# EasyEDA Pro project wt901c固定板_2026-02-21.epro

# Schematic Wt901固定板
Board Name: Board1; Create Date: 2026-02-02; Page Name: P1; Project Name: 莺飞; Schematic Name: Schematic10; Update Date: 2026-02-02; BladeWidth: 10; Company: 嘉立创EDA; Page Size: A4; RegionStart: 1; ShowBorder: 1; TitleBlock: 1; TitleBlockPosition: 3; Version: V1.0; XRegionCount: 6; YRegionCount: 4
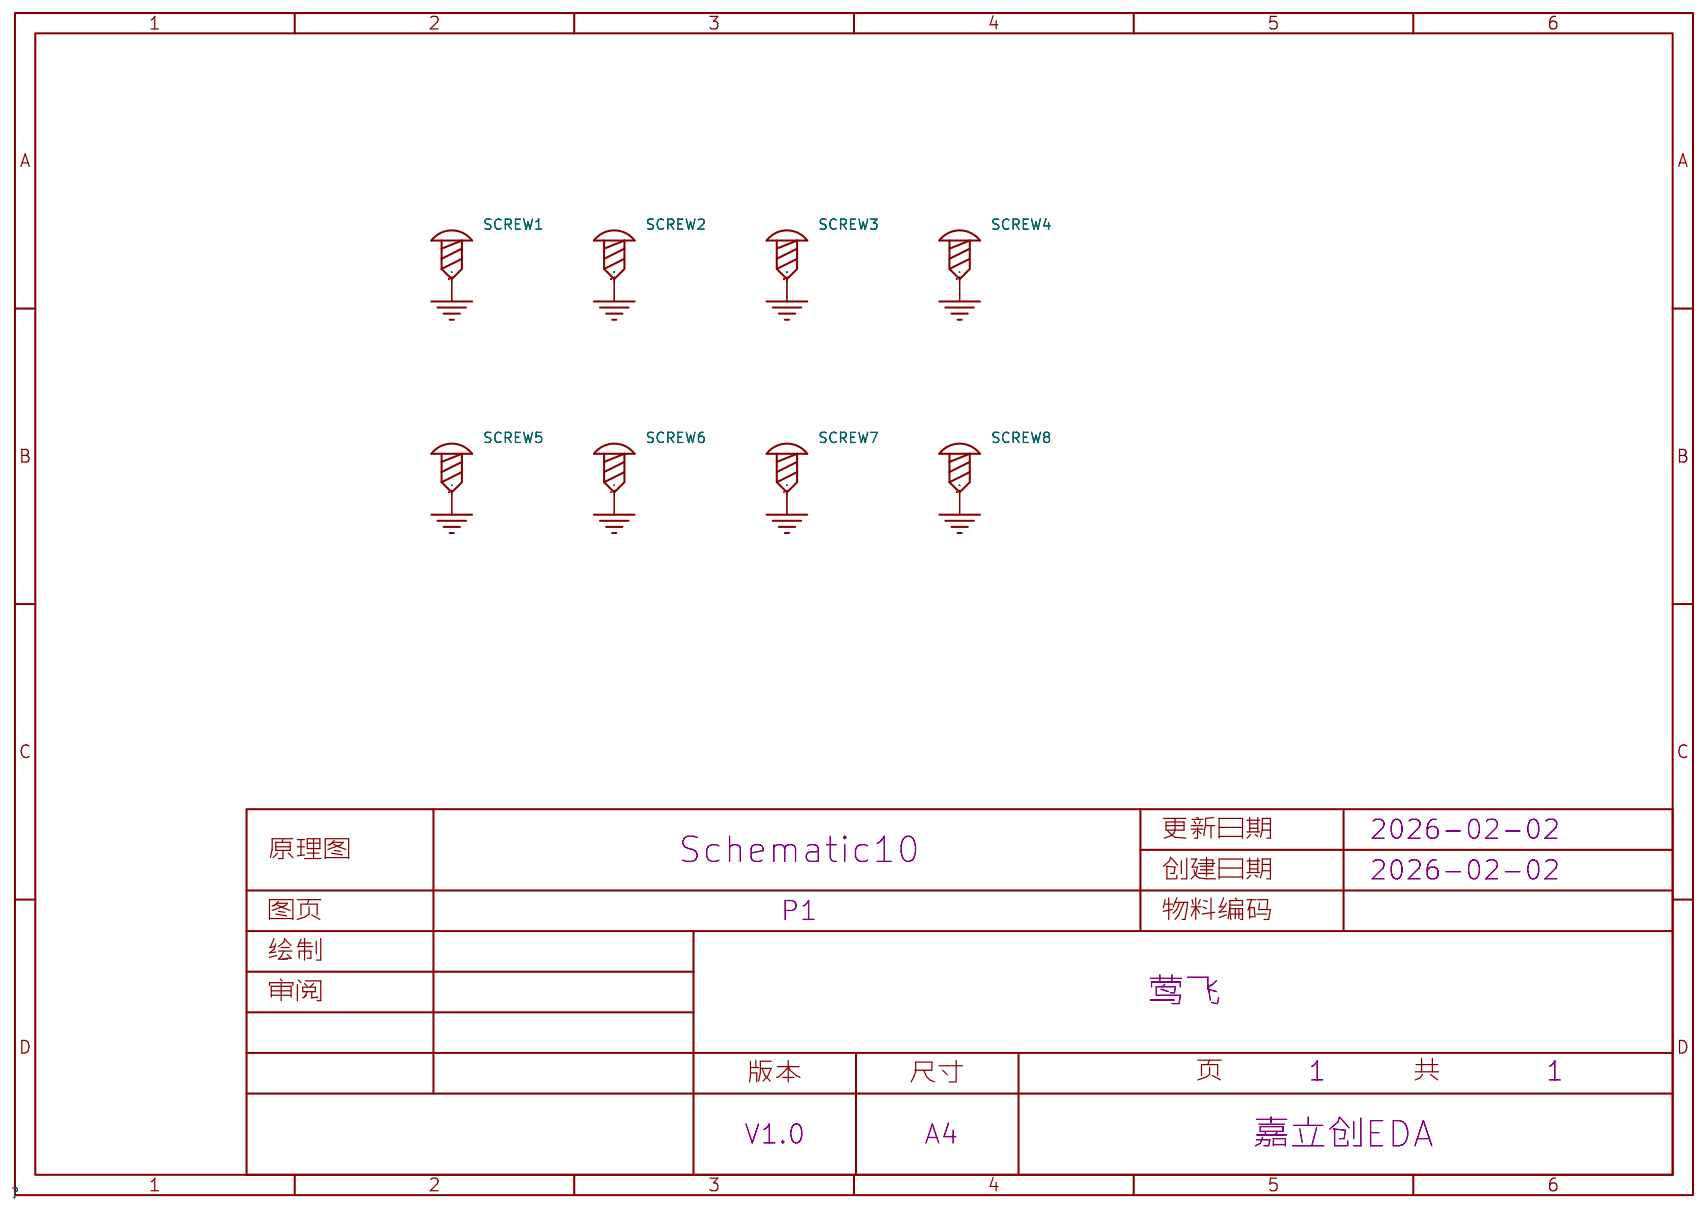
[diagram p0: schematic sheet]

## Parts
SCREW1  -  [M3螺丝]
SCREW2  -  [M3螺丝]
SCREW3  -  [M3螺丝]
SCREW4  -  [M3螺丝]
SCREW5  -  [M3螺丝]
SCREW6  -  [M3螺丝]
SCREW7  -  [M3螺丝]
SCREW8  -  [M3螺丝]

## Library data of the parts
SCREW1-SCREW8 = M3螺丝: Supplier Footprint: 插件

## Nets
GND: SCREW1.1 SCREW2.1 SCREW3.1 SCREW4.1 SCREW5.1 SCREW6.1 SCREW7.1 SCREW8.1

# Board Wt901固定板
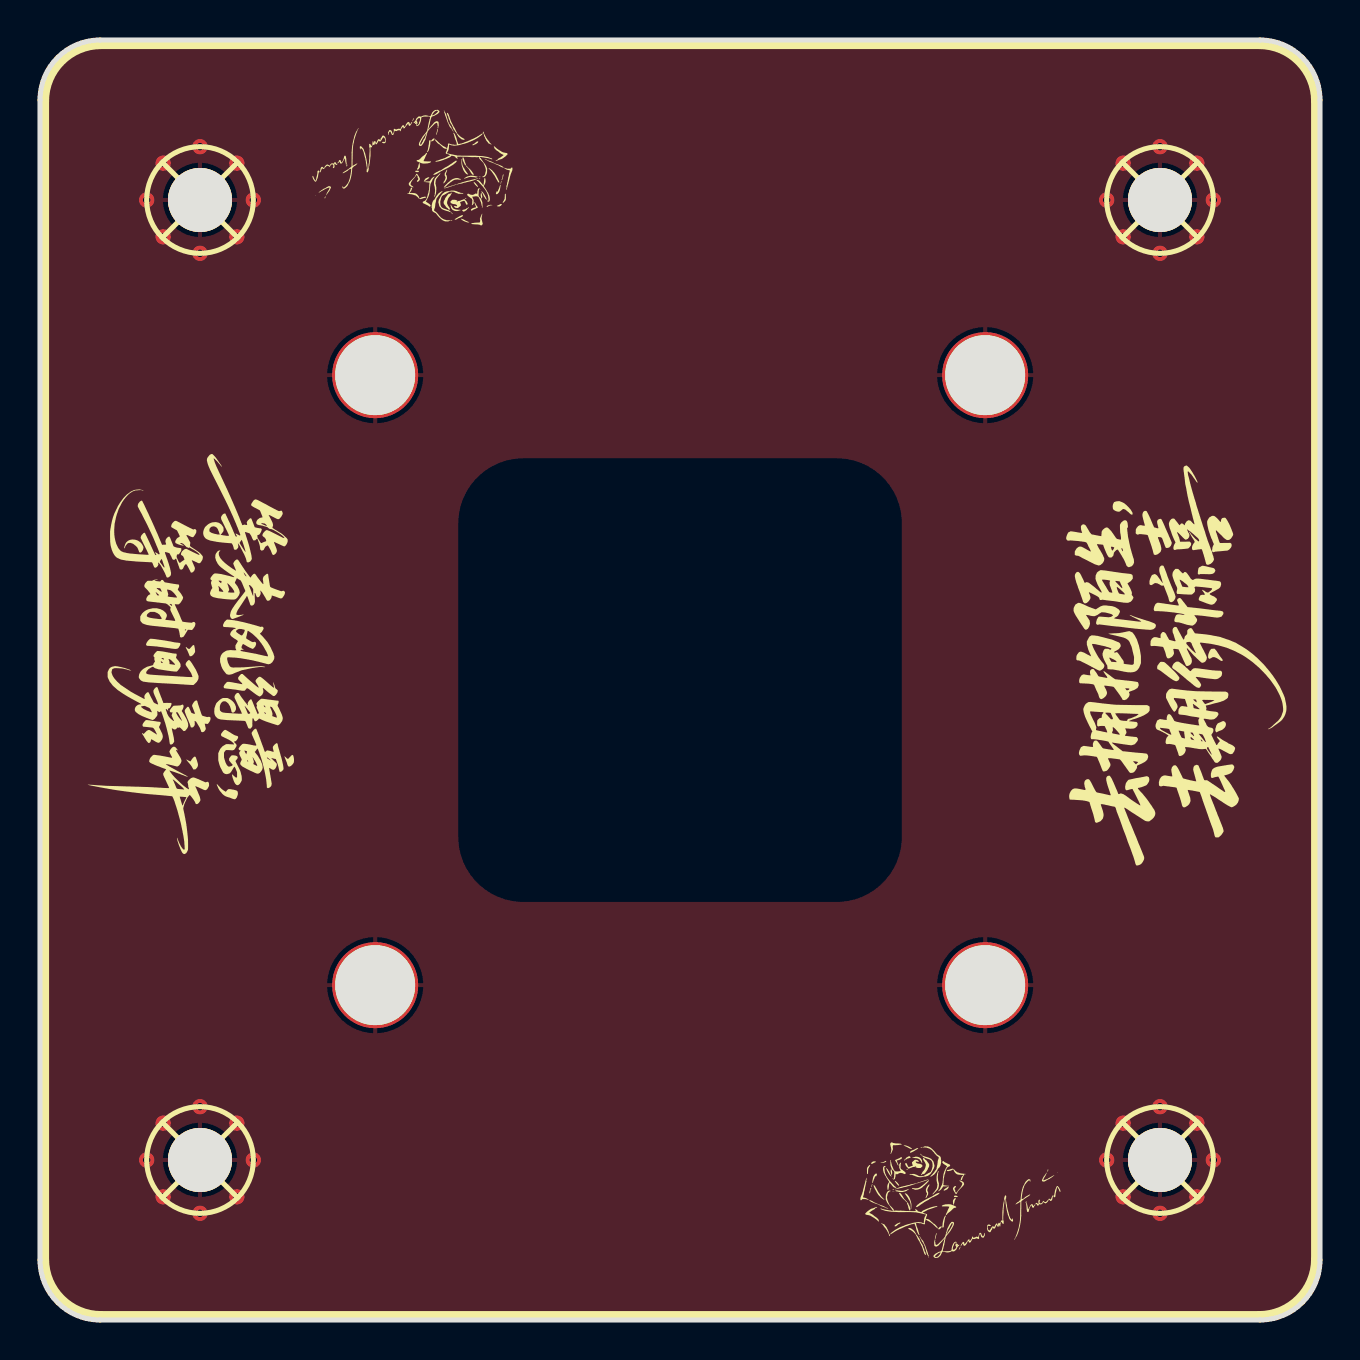
[diagram p1: board, top side]
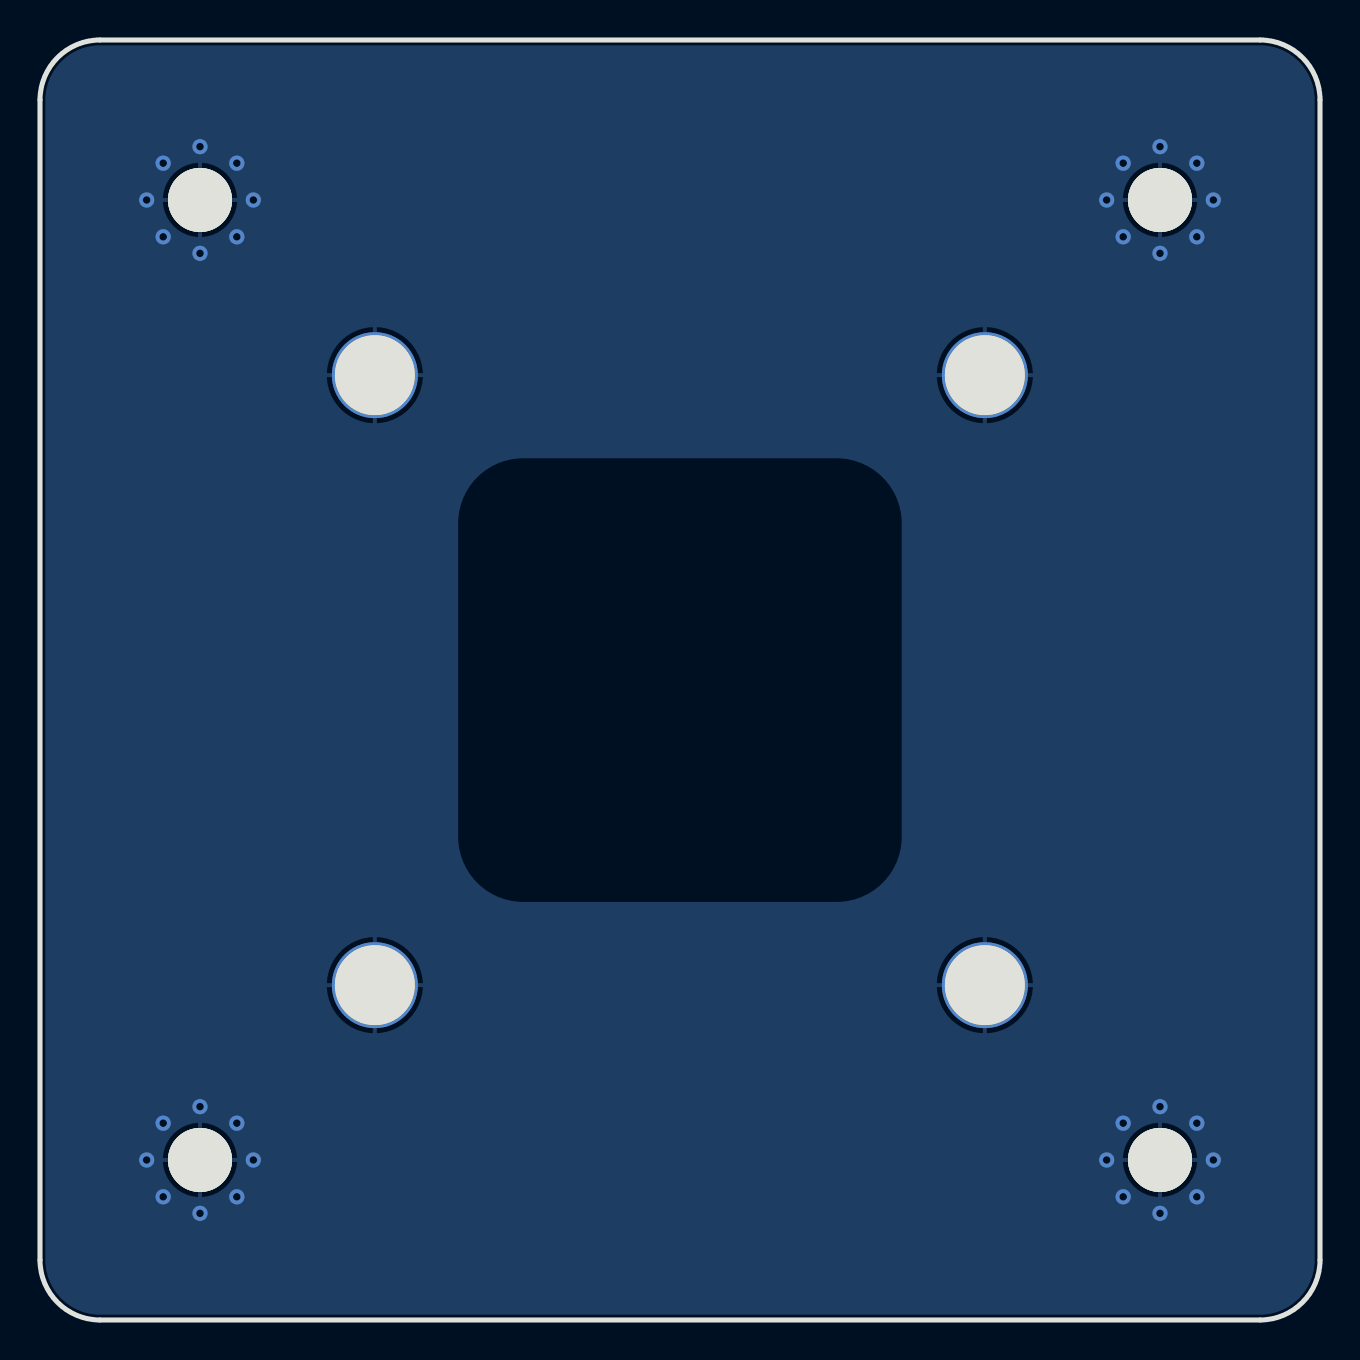
[diagram p2: board, bottom side, seen from below]

Outline 64 x 64 mm; copper layers: Top Layer, Bottom Layer. Coordinates in mm from the lower left corner of the outline.
Outline path: 0,61 0,3 arc(0.88,0.88) 3,0 61,0 arc(63.12,0.88) 64,3 64,61 arc(63.12,63.12) 61,64 3,64 arc(0.88,63.12) 0,61
Stack: Top Layer 0.035mm / Dielectric1 1.51mm FR4 er 4.5 / Bottom Layer 0.035mm

## Design rules (mm)
spacing copperThickness1oz (default): track to track 0.102, other pairs 0.152 to 0.3
spacing copperThickness2oz: track to track 0.203, other pairs 0.152 to 0.3
track width copperThickness1oz (default): min 0.127, default 0.254, max 2.54
track width copperThickness2oz: min 0.203, default 0.254, max 2.54
differential pair differentialPair (default): width min 0.127, default 0.254, max 2.54; gap min 0.152, default 0.152
net GND uses copperRegion

## Placement (name value [footprint] x y rotation side)
NOREF  -  [Pad_e2]  16.76 16.74 0 top
NOREF#2  -  [Pad_e1]  47.26 16.74 0 top
NOREF#3  -  [Pad_e4]  47.26 47.24 0 top
NOREF#4  -  [Pad_e3]  16.76 47.24 0 top
SCREW9  -  [M3螺丝_1]  8 8 0 top
SCREW10  -  [M3螺丝_1]  8 56 0 top
SCREW15  -  [M3螺丝_1]  56 8 0 top
SCREW16  -  [M3螺丝_1]  56 56 0 top

## Footprints (pads in the part's own frame, mm; a bottom-side part is the same pattern mirrored in y, then rotated)
M3螺丝_1
  round 3.2 hole 3.2: 1(0,0)
Pad_e1
  round 4.3 hole 4: 101(0,0)
Pad_e2
  round 4.3 hole 4: 101(0,0)
Pad_e3
  round 4.3 hole 4: 101(0,0)
Pad_e4
  round 4.3 hole 4: 101(0,0)

## Nets
GND: NOREF.101 NOREF#2.101 NOREF#3.101 NOREF#4.101 SCREW9.1 SCREW10.1 SCREW15.1 SCREW16.1

## Via types
v1: diameter 0.762, hole 0.381, Top Layer to Bottom Layer, 32 vias

## Routing (per net, layer and track width the routed paths; a pad name or vN(x,y) marks a point on that pad's centre or on a via; arc(x,y) is an arc through that point)
GND:
  vias: v1(5.33,56) v1(5.33,8) v1(6.16,57.84) v1(6.16,54.16) v1(6.16,9.84) v1(6.16,6.16) v1(8,58.67) v1(8,53.33) v1(8,10.67) v1(8,5.33) v1(9.84,57.84) v1(9.84,54.16) v1(9.84,9.84) v1(9.84,6.16) v1(10.67,56) v1(10.67,8) v1(53.33,56) v1(53.33,8) v1(54.16,57.84) v1(54.16,54.16) v1(54.16,9.84) v1(54.16,6.16) v1(56,58.67) v1(56,53.33) v1(56,10.67) v1(56,5.33) v1(57.84,57.84) v1(57.84,54.16) v1(57.84,9.84) v1(57.84,6.16) v1(58.67,56) v1(58.67,8)

## Copper pours and planes (outline as drawn; the poured copper is in the pictures)
GND on Top Layer: -5.21,67.56 78.36,67.56 78.36,-5.6 -5.21,-5.6
GND on Bottom Layer: -7.62,68.32 68.45,68.32 68.45,-3.44 -7.62,-3.44
